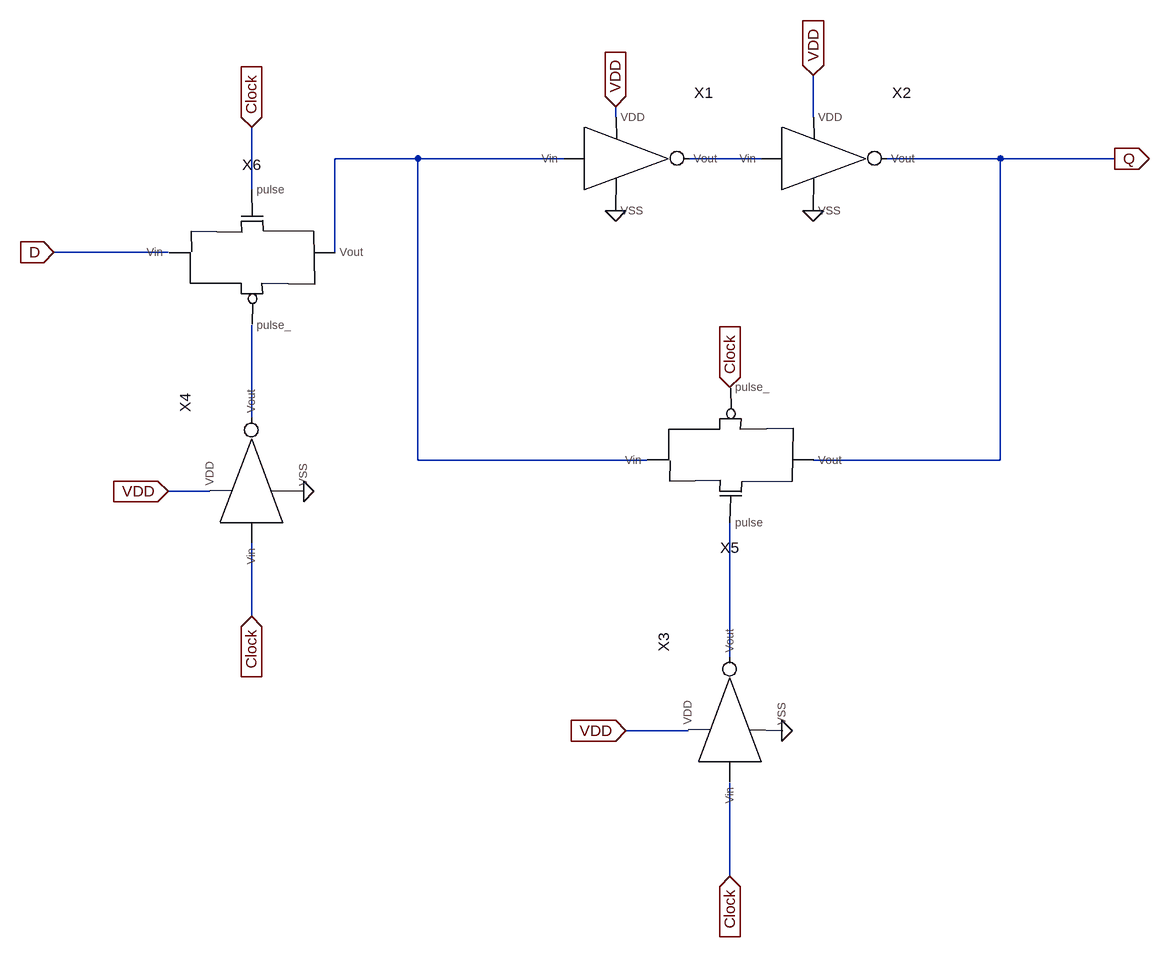
[diagram p0: schematic Latch1_T.asc]
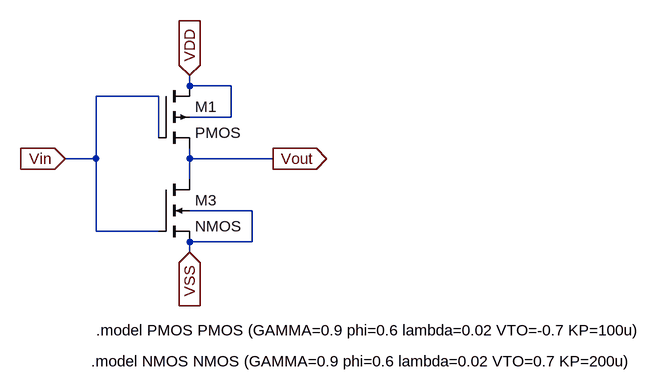
[diagram p1: sub-circuit inverter.asc]
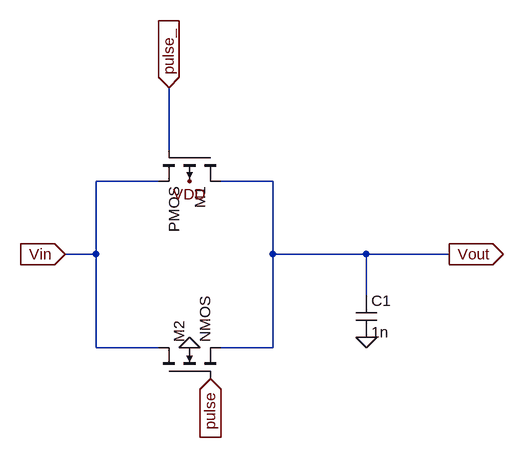
[diagram p2: sub-circuit tg_new.asc]
Latch1_T.asc, the LTspice schematic file:
Version 4
SHEET 1 2416 1192
WIRE 1264 -96 1264 -112
WIRE 1568 -96 1568 -160
WIRE 960 -32 832 -32
WIRE 1184 -32 960 -32
WIRE 1488 -32 1376 -32
WIRE 1856 -32 1680 -32
WIRE 2032 -32 1856 -32
WIRE 704 16 704 -80
WIRE 576 112 400 112
WIRE 832 112 832 -32
WIRE 704 368 704 224
WIRE 960 432 960 -32
WIRE 1312 432 960 432
WIRE 1856 432 1856 -32
WIRE 1856 432 1568 432
WIRE 640 480 576 480
WIRE 704 672 704 560
WIRE 1440 736 1440 528
WIRE 1376 848 1280 848
WIRE 1440 1072 1440 928
FLAG 1264 -112 VDD
IOPIN 1264 -112 In
FLAG 1568 -160 VDD
IOPIN 1568 -160 In
FLAG 400 112 D
IOPIN 400 112 In
FLAG 704 672 Clock
IOPIN 704 672 In
FLAG 704 -80 Clock
IOPIN 704 -80 In
FLAG 1440 320 Clock
IOPIN 1440 320 In
FLAG 1440 1072 Clock
IOPIN 1440 1072 In
FLAG 576 480 VDD
IOPIN 576 480 In
FLAG 2032 -32 Q
IOPIN 2032 -32 Out
FLAG 1280 848 VDD
IOPIN 1280 848 In
FLAG 784 480 0
FLAG 1264 48 0
FLAG 1568 48 0
FLAG 1520 848 0
SYMBOL INVERTER 1216 -32 R0
SYMATTR InstName X1
SYMBOL INVERTER 1520 -32 R0
SYMATTR InstName X2
SYMBOL INVERTER 1440 896 R270
SYMATTR InstName X3
SYMBOL INVERTER 704 528 R270
SYMATTR InstName X4
SYMBOL TG_NEW 1408 432 M180
SYMATTR InstName X5
SYMBOL TG_NEW 672 112 R0
SYMATTR InstName X6

inverter.asc, the sub-circuit schematic file:
Version 4
SHEET 1 984 680
WIRE 112 32 112 16
WIRE 176 32 112 32
WIRE 64 48 -32 48
WIRE 176 80 176 32
WIRE 176 80 112 80
WIRE 64 112 64 48
WIRE -32 144 -32 48
WIRE -32 144 -80 144
WIRE 112 144 112 128
WIRE 240 144 112 144
WIRE 112 176 112 144
WIRE 208 224 112 224
WIRE -32 256 -32 144
WIRE 64 256 -32 256
WIRE 208 272 208 224
WIRE 208 272 112 272
WIRE 112 288 112 272
FLAG -80 144 Vin
IOPIN -80 144 In
FLAG 240 144 Vout
IOPIN 240 144 Out
FLAG 112 16 VDD
IOPIN 112 16 In
FLAG 112 288 VSS
IOPIN 112 288 In
SYMBOL pmos4 64 32 R0
SYMATTR InstName M1
SYMATTR Value2 l=1u w=50u
SYMBOL nmos4 64 176 R0
SYMATTR InstName M3
SYMATTR Value2 l=1u w=100u
TEXT -32 408 Left 2 !.model PMOS PMOS (GAMMA=0.9 phi=0.6 lambda=0.02 VTO=-0.7 KP=100u)
TEXT -40 456 Left 2 !.model NMOS NMOS (GAMMA=0.9 phi=0.6 lambda=0.02 VTO=0.7 KP=200u)

tg_new.asc, the sub-circuit schematic file:
Version 4
SHEET 1 880 680
WIRE 112 16 112 -80
WIRE 96 64 0 64
WIRE 272 64 192 64
WIRE 0 176 0 64
WIRE 0 176 -48 176
WIRE 272 176 272 64
WIRE 416 176 272 176
WIRE 544 176 416 176
WIRE 416 240 416 176
WIRE 0 320 0 176
WIRE 96 320 0 320
WIRE 272 320 272 176
WIRE 272 320 192 320
FLAG 176 368 pulse
IOPIN 176 368 In
FLAG -48 176 Vin
IOPIN -48 176 In
FLAG 544 176 Vout
IOPIN 544 176 Out
FLAG 416 304 0
FLAG 144 320 0
FLAG 144 64 VDD
FLAG 112 -80 pulse_
IOPIN 112 -80 In
SYMBOL pmos4 192 16 R90
SYMATTR InstName M1
SYMBOL nmos4 96 368 R270
SYMATTR InstName M2
SYMBOL cap 400 240 R0
SYMATTR InstName C1
SYMATTR Value 1n

The netlist it stands for:
* Latch1_T.asc
XX1 VDD N001 0 N002 inverter
XX2 VDD N002 0 Q inverter
XX3 VDD Clock 0 N004 inverter
XX4 VDD Clock 0 N003 inverter
XX5 N004 Clock N001 Q tg_new
XX6 Clock N003 D N001 tg_new

* block symbol definitions
.subckt inverter VDD Vin VSS Vout
M1 VDD Vin Vout VDD PMOS l=1u w=50u
M3 Vout Vin VSS VSS NMOS l=1u w=100u
.model PMOS PMOS (GAMMA=0.9 phi=0.6 lambda=0.02 VTO=-0.7 KP=100u)
.model NMOS NMOS (GAMMA=0.9 phi=0.6 lambda=0.02 VTO=0.7 KP=200u)
.ends inverter

.subckt tg_new pulse pulse_ Vin Vout
M1 Vout pulse_ Vin VDD PMOS
M2 Vin pulse Vout 0 NMOS
C1 Vout 0 1n
.ends tg_new

.model NMOS NMOS
.model PMOS PMOS
.lib standard.mos
.backanno
.end